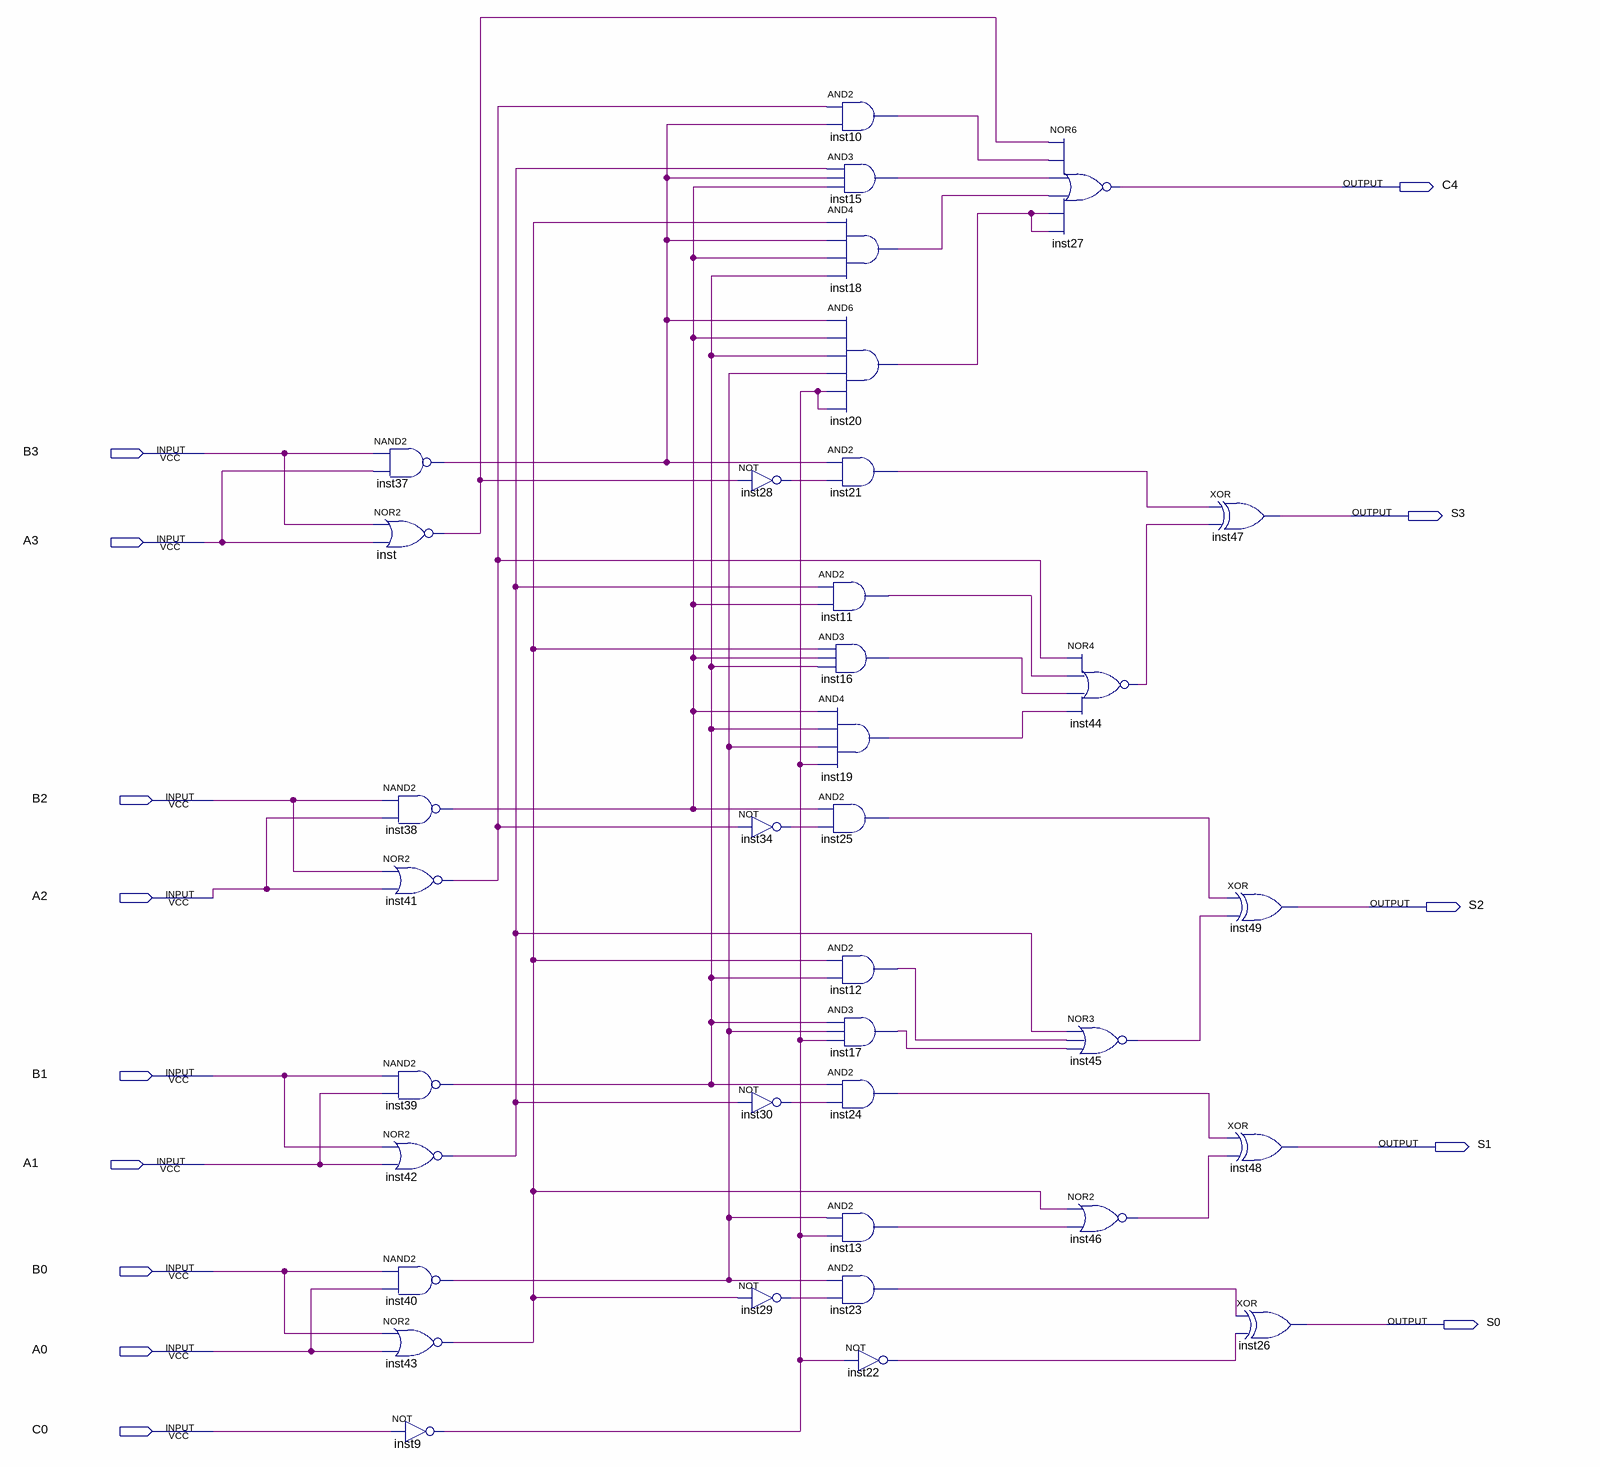
[diagram p0: schematic sheet]
// Quartus schematic CI74LS283.bdf as structural Verilog: 36 symbols, 14 pins
module CI74LS283 (
  input  B3,
  input  A3,
  input  B2,
  input  A2,
  input  B1,
  input  A1,
  input  B0,
  input  A0,
  input  C0,
  output C4,
  output S3,
  output S2,
  output S1,
  output S0
);

  wire inst9_out, inst10_out, inst11_out, inst12_out, inst13_out, inst15_out, inst16_out, inst17_out,
       inst18_out, inst19_out, inst20_out, inst21_out, inst22_out, inst23_out, inst24_out, inst25_out,
       inst28_out, inst29_out, inst30_out, inst34_out, inst37_out, inst38_out, inst39_out, inst40_out,
       inst41_out, inst42_out, inst43_out, inst44_out, inst45_out, inst46_out, inst_out;

  nand inst37 (inst37_out, B3, A3);
  nor inst (inst_out, B3, A3);
  nand inst38 (inst38_out, B2, A2);
  nor inst41 (inst41_out, B2, A2);
  nand inst39 (inst39_out, B1, A1);
  nor inst42 (inst42_out, B1, A1);
  nand inst40 (inst40_out, B0, A0);
  nor inst43 (inst43_out, B0, A0);
  not inst9 (inst9_out, C0);
  not inst28 (inst28_out, inst_out);
  not inst34 (inst34_out, inst41_out);
  not inst30 (inst30_out, inst42_out);
  not inst29 (inst29_out, inst43_out);
  and inst10 (inst10_out, inst41_out, inst37_out);
  and inst15 (inst15_out, inst42_out, inst37_out, inst38_out);
  and inst18 (inst18_out, inst43_out, inst37_out, inst38_out, inst39_out);
  and inst20 (inst20_out, inst37_out, inst38_out, inst39_out, inst40_out, inst9_out, inst9_out);
  and inst21 (inst21_out, inst37_out, inst28_out);
  and inst11 (inst11_out, inst42_out, inst38_out);
  and inst16 (inst16_out, inst43_out, inst38_out, inst39_out);
  and inst19 (inst19_out, inst38_out, inst39_out, inst40_out, inst9_out);
  and inst25 (inst25_out, inst38_out, inst34_out);
  and inst12 (inst12_out, inst43_out, inst39_out);
  and inst17 (inst17_out, inst39_out, inst40_out, inst9_out);
  and inst24 (inst24_out, inst39_out, inst30_out);
  and inst13 (inst13_out, inst40_out, inst9_out);
  and inst23 (inst23_out, inst40_out, inst29_out);
  not inst22 (inst22_out, inst9_out);
  nor inst27 (C4, inst_out, inst10_out, inst15_out, inst18_out, inst20_out, inst20_out);
  nor inst44 (inst44_out, inst41_out, inst11_out, inst16_out, inst19_out);
  nor inst45 (inst45_out, inst42_out, inst12_out, inst17_out);
  nor inst46 (inst46_out, inst43_out, inst13_out);
  xor inst47 (S3, inst21_out, inst44_out);
  xor inst49 (S2, inst25_out, inst45_out);
  xor inst48 (S1, inst24_out, inst46_out);
  xor inst26 (S0, inst23_out, inst22_out);
endmodule
